# Altium schematic sheet main.SchDoc: BatteryProtector IPA 2021
size A3; Date: 29.03.2021; CompanyName: ETH Zürich; DrawnBy: Marco Stauber; Engineer: Marco Stauber; Organization: IDSC; DocumentNumber: -; Revision: 1.0; SheetNumber: 1; SheetTotal: 1
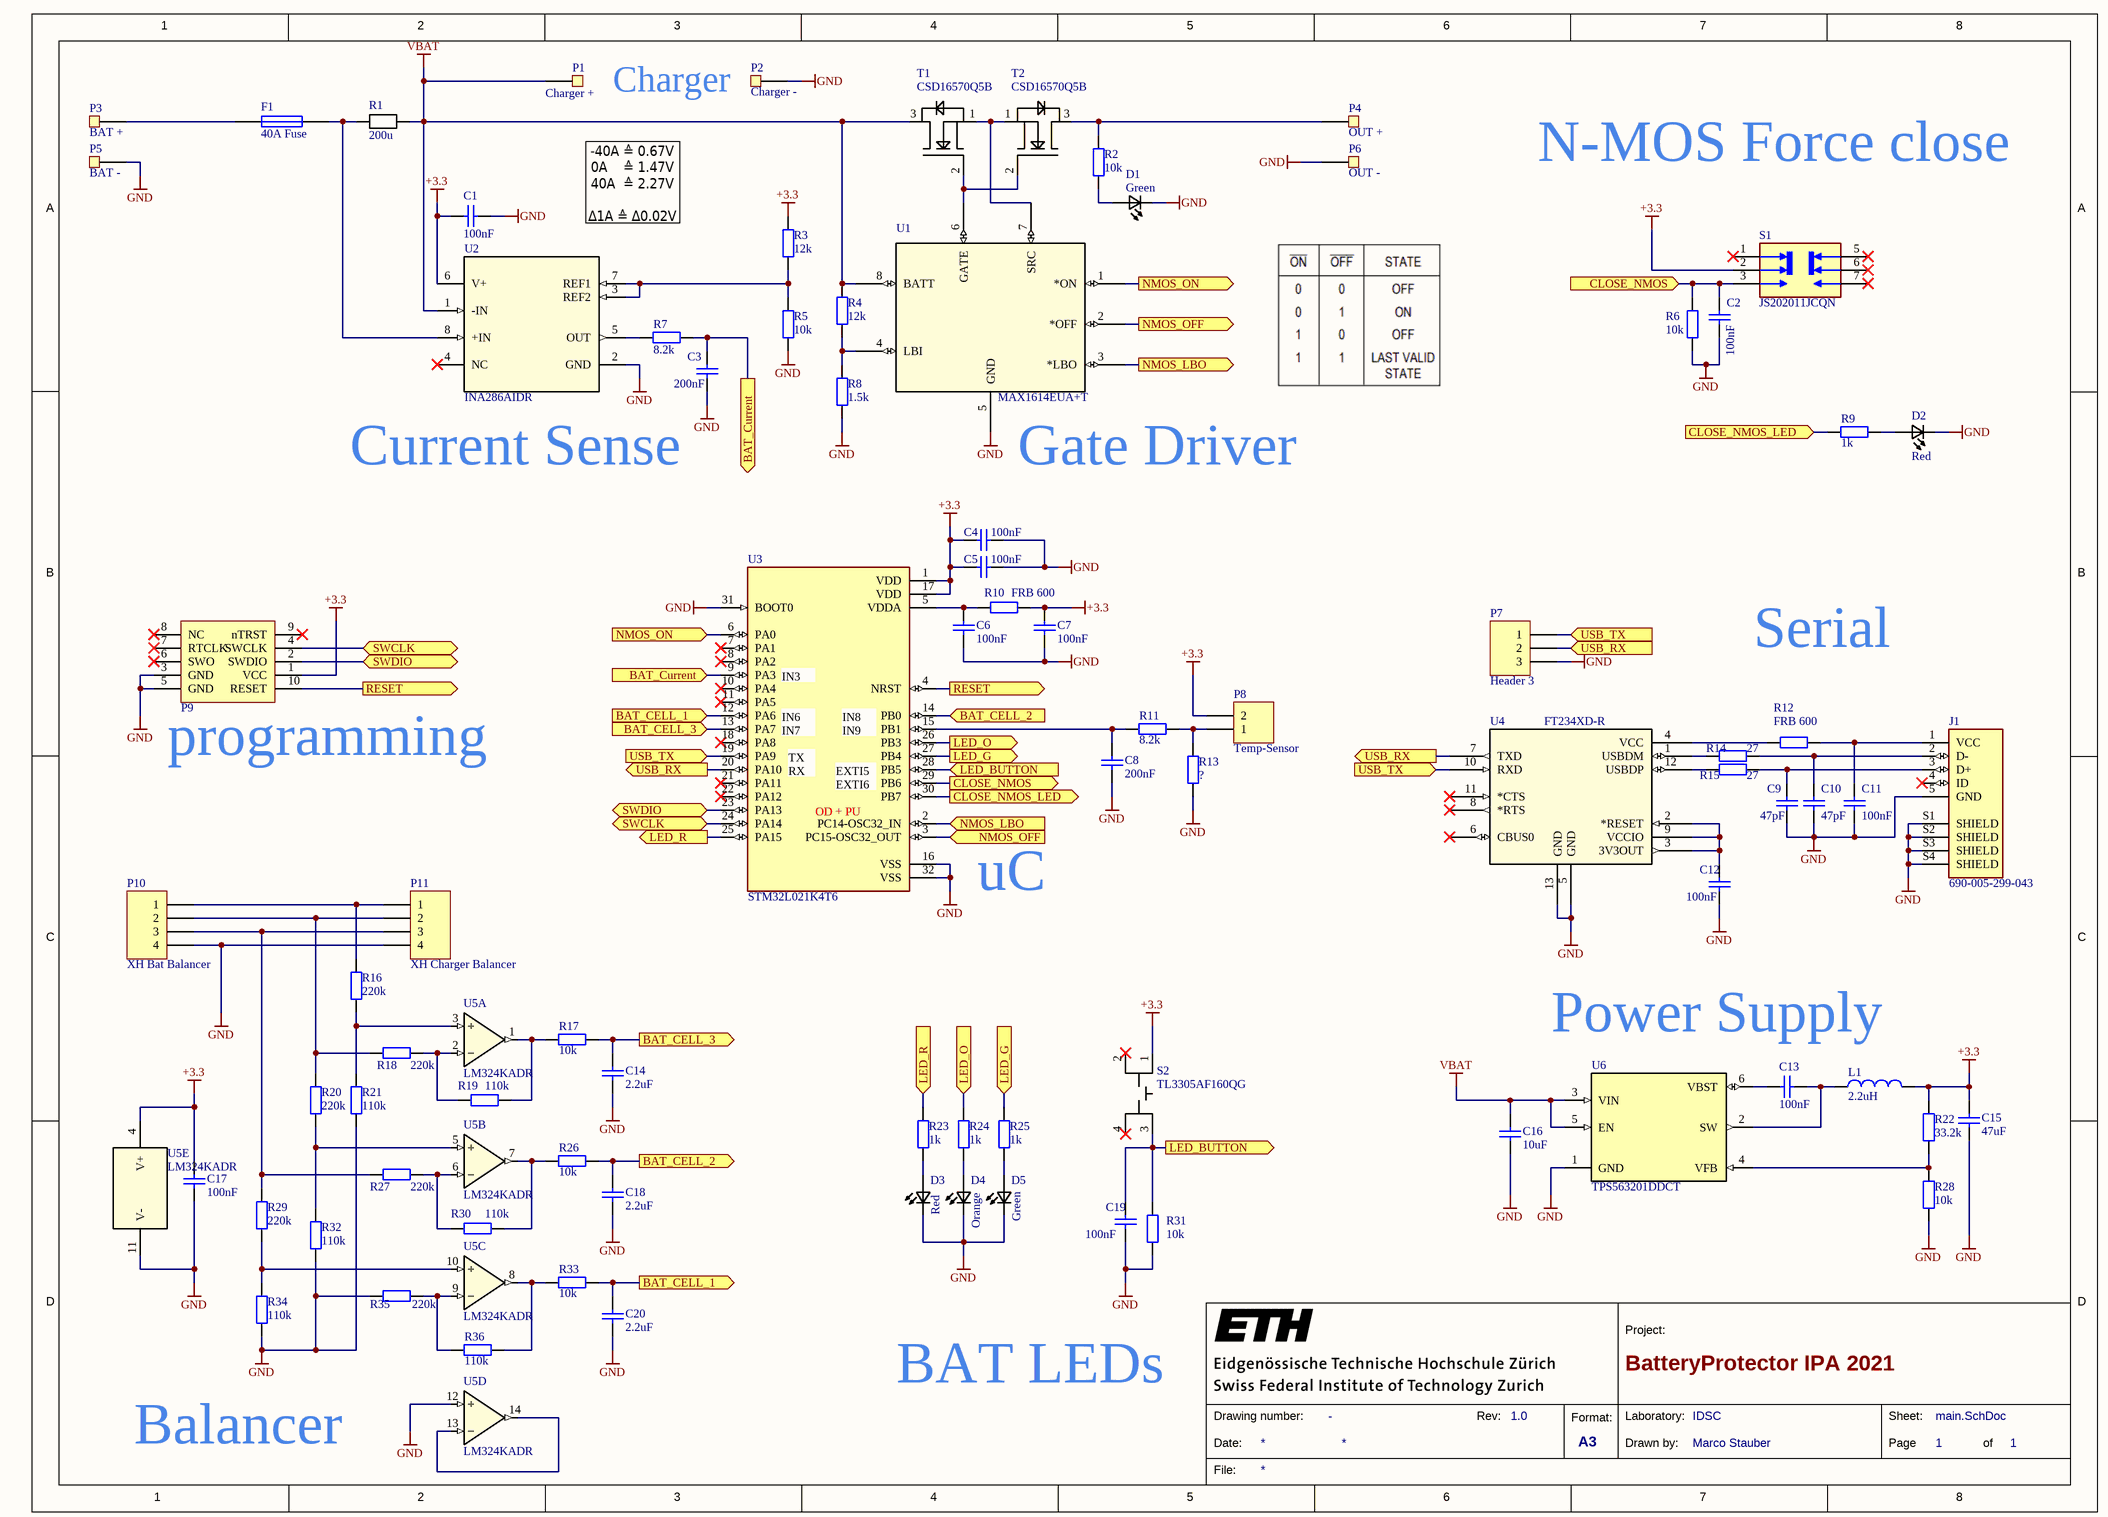
[diagram p0: main.SchDoc]

## Parts
C1  100nF  [CAP_0402i_1005m -L]
C2  100nF  [CAP_0402i_1005m -L]
C3  200nF  [CAP_0402i_1005m -L]
C4  100nF  [CAP_0402i_1005m -L]
C5  100nF  [CAP_0402i_1005m -L]
C6  100nF  [CAP_0402i_1005m -L]
C7  100nF  [CAP_0402i_1005m -L]
C8  200nF  [CAP_0402i_1005m -L]
C9  47pF  [CAP_0402i_1005m -L]
C10  47pF  [CAP_0402i_1005m -L]
C11  100nF  [CAP_0402i_1005m -L]
C12  100nF  [CAP_0402i_1005m -L]
C13  100nF  [CAP_0402i_1005m -L]
C14  2.2uF  [CAP_0805i_2012m -L]
C15  47uF  [CAP_1206i_3216m -n]
C16  10uF  [CAP_0805i_2012m -L]
C17  100nF  [CAP_0402i_1005m -L]
C18  2.2uF  [CAP_0805i_2012m -L]
C19  100nF  [CAP_0402i_1005m -L]
C20  2.2uF  [CAP_0805i_2012m -L]
D1  Green  [0603_LED]
D2  Red  [0603_LED]
D3  Red  [0603_LED]
D4  Orange  [0603_LED]
D5  Green  [0603_LED]
F1  40A Fuse  [FUSE_1206I_3216M_N]
J1  690-005-299-043  [EDAC_690-005-299-043]
L1  2.2uH  [IND_1210i_3225m -L]
P1  Charger +  [AWG-10-Hole-1]
P2  Charger -  [AWG-10-Hole-1]
P3  BAT +  [AWG-10-Hole-1]
P4  OUT +  [AWG-10-Hole-1]
P5  BAT -  [AWG-10-Hole-1]
P6  OUT -  [AWG-10-Hole-1]
P7  Header 3  [1.27mm HDR1X3]
P8  Temp-Sensor  [HDR1X2]
P9  Tag-Connect TC2050-IDC-NL-No pin assigned  [TAG-CONNECT TC2050-IDC-NL 10-Pin]  (value not drawn)
P10  XH Bat Balancer  [JST_B4B-XH-A(LF)(SN)]
P11  XH Charger Balancer  [JST_B4B-XH-A(LF)(SN)]
R1  200u  [WSL3921L2000FEA]
R2  10k  [RES_0402i_1005m -N]
R3  12k  [RES_0402i_1005m -N]
R4  12k  [RES_0402i_1005m -N]
R5  10k  [RES_0402i_1005m -N]
R6  10k  [RES_0402i_1005m -N]
R7  8.2k  [RES_0402m_1005i -L]
R8  1.5k  [RES_0402i_1005m -N]
R9  1k  [RES_0402i_1005m -N]
R10  FRB 600  [RES_0603i_1608m -N]
R11  8.2k  [RES_0402m_1005i -L]
R12  FRB 600  [RES_0603i_1608m -N]
R13  ?  [RES_0402m_1005i -L]
R14  27  [RES_0402i_1005m -N]
R15  27  [RES_0402i_1005m -N]
R16  220k  [RES_0402i_1005m -N]
R17  10k  [RES_0402i_1005m -N]
R18  220k  [RES_0402i_1005m -N]
R19  110k  [RES_0402i_1005m -N]
R20  220k  [RES_0402i_1005m -N]
R21  110k  [RES_0402i_1005m -N]
R22  33.2k  [RES_0402i_1005m -N]
R23  1k  [RES_0402i_1005m -N]
R24  1k  [RES_0402i_1005m -N]
R25  1k  [RES_0402i_1005m -N]
R26  10k  [RES_0402i_1005m -N]
R27  220k  [RES_0402i_1005m -N]
R28  10k  [RES_0402i_1005m -N]
R29  220k  [RES_0402i_1005m -N]
R30  110k  [RES_0402i_1005m -N]
R31  10k  [RES_0402i_1005m -N]
R32  110k  [RES_0402i_1005m -N]
R33  10k  [RES_0402i_1005m -N]
R34  110k  [RES_0402i_1005m -N]
R35  220k  [RES_0402i_1005m -N]
R36  110k  [RES_0402i_1005m -N]
S1  JS202011JCQN  [SW_JS202011JCQN]
S2  TL3305AF160QG  [TL3305AF160QG]
T1  CSD16570Q5B  [CSD16570Q5B]
T2  CSD16570Q5B  [CSD16570Q5B]
U1  MAX1614EUA+T  [21-0036K_MXM-L]
U2  INA286AIDR  [D0008A_M]
U3  STM32L021K4T6  [QFP80P900X900X160-32N]
U4  FT234XD-R  [DFN-12_FTD]
U5  LM324KADR  [SOIC127P600X175-14N]  (parts A,B,C,D,E of 5)
U6  TPS563201DDCT  [SOT95P280X110-6N]

## Ports
BAT_CELL_1 (in), BAT_CELL_1 (out), BAT_CELL_2 (in), BAT_CELL_2 (out), BAT_CELL_3 (in), BAT_CELL_3 (out), BAT_Current (in), BAT_Current (out), CLOSE_NMOS (in), CLOSE_NMOS (out), CLOSE_NMOS_LED (in), CLOSE_NMOS_LED (out), LED_BUTTON (in), LED_BUTTON (out), LED_G (in), LED_G (out), LED_O (in), LED_O (out), LED_R (in), LED_R (out), NMOS_LBO (in), NMOS_LBO (out), NMOS_OFF (in), NMOS_OFF (out), NMOS_ON (in), NMOS_ON (out), RESET (out), SWCLK (bidir), SWDIO (bidir), USB_RX (in), USB_RX (out), USB_TX (in)

## Nets
+3.3: C1.2 C4.1 C5.1 C7.2 C15.2 C17.2 L1.2 P8.2 P9.1(VCC) R3.1 R10.2 R22.2 S1.2 S2.1 U2.6(V+) U3.1(VDD) U3.17(VDD) U5.4(V+)
GND: C1.1 C2.1 C3.2 C4.2 C5.2 C6.1 C7.1 C8.2 C9.1 C10.1 C11.1 C12.1 C14.1 C15.1 C16.1 C17.1 C18.1 C19.1 C20.1 D1.1(K2) D2.1(K2) D3.1(K2) D4.1(K2) D5.1(K2) J1.5(GND) J1.S1(SHIELD) J1.S2(SHIELD) J1.S3(SHIELD) J1.S4(SHIELD) P2.1 P5.1 P6.1 P7.3 P9.3(GND) P9.5(GND) P10.4 P11.4 R5.1 R6.1 R8.1 R13.1 R21.1 R28.1 R31.1 R32.1 R34.1 R35.2 U1.5(GND) U2.2(GND) U3.16(VSS) U3.31(BOOT0) U3.32(VSS) U4.5(GND) U4.13(GND) U5.11(V-) U5.12(INPUTSA) U6.1(GND)
VBAT: C16.2 P1.1 R1.2 R4.1 T1.3(D) U1.8(BATT) U2.1(-IN) U6.3(VIN) U6.5(EN)
BAT_CELL_1: C20.2 R33.2 U3.12(PA6) ; port BAT_CELL_1
BAT_CELL_2: C18.2 R26.2 U3.14(PB0) ; port BAT_CELL_2
BAT_CELL_3: C14.2 R17.2 U3.13(PA7) ; port BAT_CELL_3
BAT_Current: C3.1 R7.2 U3.9(PA3) ; port BAT_Current
CLOSE_NMOS: C2.2 R6.2 S1.3 U3.29(PB6) ; port CLOSE_NMOS
CLOSE_NMOS_LED: R9.2 U3.30(PB7) ; port CLOSE_NMOS_LED
LED_BUTTON: C19.2 R31.2 S2.3 U3.28(PB5) ; port LED_BUTTON
LED_G: R25.2 U3.27(PB4) ; port LED_G
LED_O: R24.2 U3.26(PB3) ; port LED_O
LED_R: R23.2 U3.25(PA15) ; port LED_R
NMOS_LBO: U1.3(*LBO) U3.2(PC14-OSC32_IN) ; port NMOS_LBO
NMOS_OFF: U1.2(*OFF) U3.3(PC15-OSC32_OUT) ; port NMOS_OFF
NMOS_ON: U1.1(*ON) U3.6(PA0) ; port NMOS_ON
RESET: P9.10(RESET) U3.4(NRST) ; port RESET
SWCLK: P9.4(SWCLK) U3.24(PA14) ; port SWCLK
SWDIO: P9.2(SWDIO) U3.23(PA13) ; port SWDIO
USB_RX: P7.2 U3.20(PA10) U4.7(TXD) ; port USB_RX
USB_TX: P7.1 U3.19(PA9) U4.10(RXD) ; port USB_TX
NetC6_2: C6.2 R10.1 U3.5(VDDA)
NetC8_1: C8.1 R11.2 U3.15(PB1)
NetC9_2: C9.2 J1.3(D+) R15.2
NetC10_2: C10.2 J1.2(D-) R14.2
NetC11_2: C11.2 J1.1(VCC) R12.2
NetC12_2: C12.2 U4.2(*RESET) U4.3(3V3OUT) U4.9(VCCIO)
NetC13_1: C13.1 U6.6(VBST)
NetC13_2: C13.2 L1.1 U6.2(SW)
NetD1_2: D1.2(A2) R2.2
NetD2_2: D2.2(A2) R9.1
NetD3_2: D3.2(A2) R23.1
NetD4_2: D4.2(A2) R24.1
NetD5_2: D5.2(A2) R25.1
NetF1_1: F1.1 P3.1
NetF1_2: F1.2 R1.1 U2.8(+IN)
NetP4_1: P4.1 R2.1 T2.3(D)
NetP8_1: P8.1 R11.1 R13.2
NetP10_1: P10.1 P11.1 R16.2
NetP10_2: P10.2 P11.2 R18.2 R20.2
NetP10_3: P10.3 P11.3 R27.2 R29.2
NetR3_2: R3.2 R5.2 U2.3(REF2) U2.7(REF1)
NetR4_2: R4.2 R8.2 U1.4(LBI)
NetR7_1: R7.1 U2.5(OUT)
NetR12_1: R12.1 U4.4(VCC)
NetR14_1: R14.1 U4.1(USBDM)
NetR15_1: R15.1 U4.12(USBDP)
NetR16_1: R16.1 R21.2 U5.3(INPUTSA)
NetR17_1: R17.1 R19.1 U5.1(OUTPUTA)
NetR18_1: R18.1 R19.2 U5.2(INPUTSA)
NetR20_1: R20.1 R32.2 U5.5(INPUTSA)
NetR22_1: R22.1 R28.2 U6.4(VFB)
NetR26_1: R26.1 R30.1 U5.7(OUTPUTA)
NetR27_1: R27.1 R30.2 U5.6(INPUTSA)
NetR29_1: R29.1 R34.2 U5.10(INPUTSA)
NetR33_1: R33.1 R36.2 U5.8(OUTPUTA)
NetR35_1: R35.1 R36.1 U5.9(INPUTSA)
NetT1_1: T1.1(S) T2.1(S) U1.7(SRC)
NetT1_2: T1.2(G) T2.2(G) U1.6(GATE)
NetU5_13: U5.13(INPUTSA) U5.14(OUTPUTA)

Not connected (* = marked no-connect by the designer): J1 4(ID)*; P9 6(SWO)* 7(RTCLK)* 8(NC)* 9(nTRST)*; S1 1* 5* 6* 7*; S2 2* 4*; U2 4(NC)*; U3 7(PA1)* 8(PA2)* 10(PA4)* 11(PA5)* 18(PA8)* 21(PA11)* 22(PA12)*; U4 6(CBUS0)* 8(*RTS)* 11(*CTS)*

## Notes on the sheet
- (near P2) Charger
- N-MOS Force close
- -40A ≙ 0.67V
  0A    ≙ 1.47V
  40A  ≙ 2.27V
  ∆1A ≙ ∆0.02V
- Current Sense
- (near U1) Gate Driver
- Serial
- (near U3) IN6
  IN7
- (near U3) IN3
- (near U3) IN8
  IN9
- (near P9) programming
- (near U3) TX
  RX
- (near U3) EXTI5
  EXTI6
- (near U3) OD + PU
- uC
- Power Supply
- BAT LEDs
- Balancer
- 1
- 2
- 3
- 4
- 5
- 6
- 7
- 8
- A
- B
- C
- D
- Project:
- Date:
- Drawing number:
- Rev:
- Format:
- A3
- Drawn by:
- Laboratory:
- Page
- Sheet:
- of
- File:

## Library data of the parts
C1-C20 = Cap: capacitor
D1-D5 = LTST-C191KRKT: Red 631nm LED Indication - Discrete 2V 0603 _1608 Metric_; MF: Lite-On Inc.; Value: *; Package: 0603 Lite-On; Digi-Key_Purchase_URL: https://www.digikey.in/product-detail/en/lite-on-inc/LTST-C191KRKT/160-1447-1-ND/386836?utm_source=snapeda&utm_medium=aggregator&utm_campaign=symbol; SnapEDA_Link: https://www.snapeda.com/parts/LTST-C191KRKT/Lite-On%20Inc./view-part/234319/?ref=snap; Digi-Key_Part_Number: 160-1447-1-ND; MP: LTST-C191KRKT
F1 = Fuse
J1 = 690-005-299-043: USB - mini B USB 2.0 Receptacle Connector 5 Position Surface Mount, Right Angle; MF: EDAC Inc.; Price: None; Purchase-URL: https://pricing.snapeda.com/search/part/690-005-299-043/?ref=eda; Check_prices: https://www.snapeda.com/parts/690-005-299-043/EDAC%20Inc./view-part/347309/?ref=eda; Value: *; SnapEDA_Link: https://www.snapeda.com/parts/690-005-299-043/EDAC%20Inc./view-part/347309/?ref=snap; Availability: Good; MP: 690-005-299-043; Package: None
L1 = Inductor
P1-P6 = Pin
P7 = Header 3: Header, 3-Pin
P8 = Header 2: Header, 2-Pin
P9 = Tag-Connect TC2050-IDC-NL-No pin assigned: 10-pin pogo pin programing port
P10 P11 = Header 4: Header, 4-Pin
R1 = WSL3921L2000FEA: RES 200 UOHM 1% 3W
R2-R36 = Res: Resistor
S1 = JS202011JCQN: Slide Switch DPDT Surface Mount; MF: C&K; Package: None; Availability: Good; Value: *; MP: JS202011JCQN; SnapEDA_Link: https://www.snapeda.com/parts/JS202011JCQN/C&K/view-part/587766/?ref=snap; Price: None; Purchase-URL: https://pricing.snapeda.com/search/part/JS202011JCQN/?ref=eda
T1 T2 = CSD16570Q5B: Power NMOS; Vendor: Texas Instruments; Built_By: EMA_UL_Team; Type: DEV; Manufacturer_Part_Number: CSD16570Q5B; Copyright: Copyright (C) 2018 Accelerated Designs. All rights reserved; RefDes: RefDes
U1 = MAX1614EUA+T: No Description Available; Vendor: Maxim Integrated Products; Built_By: EMA_UL_Team; SourceLibrary: Maxim_2014-04-30_1; Manufacturer_Part_Number: MAX1614EUA+T; Revision: 2; Copyright: Copyright (C) 2018 Accelerated Designs. All rights reserved; RefDes: RefDes; Type: DEV
U2 = INA286AIDR: No Description Available; Manufacturer: Texas Instruments; CompType: IC; PIN_COUNT: 8; PartNumber: INA286AIDR; Alternate_PartNumber: INA286AID; PackageReference: D0008A; MountType: SMT; RoHS: Y; RefDes: RefDes; Type: DEV; Value: Value; Copyright: Copyright (C) 2018 Accelerated Designs. All rights reserved
U3 = STM32L051K6T6: ARM® Cortex®-M0+ STM32L0 Microcontroller IC 32-Bit 32MHz 32KB (32K x 8) FLASH 32-LQFP (7x7); MF: STMicroelectronics; Check_prices: https://www.snapeda.com/parts/STM32L051K6T6/STMicroelectronics/view-part/555945/?ref=eda; Value: *; MP: STM32L051K6T6; SnapEDA_Link: https://www.snapeda.com/parts/STM32L051K6T6/STMicroelectronics/view-part/555945/?ref=snap; Availability: Bad; Price: None; Package: LQFP-32 STMicroelectronics
U4 = FT234XD-R: No Description Available; Vendor: FTDI, Future Technology Devices International Ltd; Built_By: EMA_UL_Team; SourceLibrary: FTDI_2017-04-18; Manufacturer_Part_Number: FT234XD-R; Copyright: Copyright (C) 2018 Accelerated Designs. All rights reserved; RefDes: RefDes; Type: DEV
U5 = LM324KADR: MP: LMC6044IM/NOPB; Package: None; Price: None; Value: *; Availability: Unavailable
U6 = TPS561201DDCR: 4.5V to 17V Input, 1A Synchronous Step-Down Voltage Regulator in 6-pin SOT-23 6-SOT-23-THIN -40 to 125; MF: Texas Instruments; MP: TPS561201DDCR; SnapEDA_Link: https://www.snapeda.com/parts/TPS561201DDCR/Texas%20Instruments/view-part/1775281/?ref=snap; Mouser-Purchase-URL: https://snapeda.com/shop?store=Mouser&id=1775281; Price: None; Availability: Good; Texas_Instruments-Purchase-URL: https://snapeda.com/shop?store=Texas+Instruments&id=1775281; Package: SOT-23-THN-6 Texas Instruments; DigiKey-Purchase-URL: https://snapeda.com/shop?store=DigiKey&id=1775281; Value: *; Arrow_Electronics-Purchase-URL: https://snapeda.com/shop?store=Arrow+Electronics&id=1775281